# Altium schematic sheet 1_P1.schdoc
size 309 x 223 mm; Symbol: Sheet-Symbol_A4; Device: Sheet-Symbol_A4; @Page Name: P1; @Create Date: 2023-08-24; @Page Count: 1; @Page No: 1; @Project Name: 5Vcharge_2023-08-24_11-31-12; @Schematic Name: Schematic1; @Update Date: 2023-09-03; Company: 嘉立创EDA; Page Size: A4; Version: V1.0
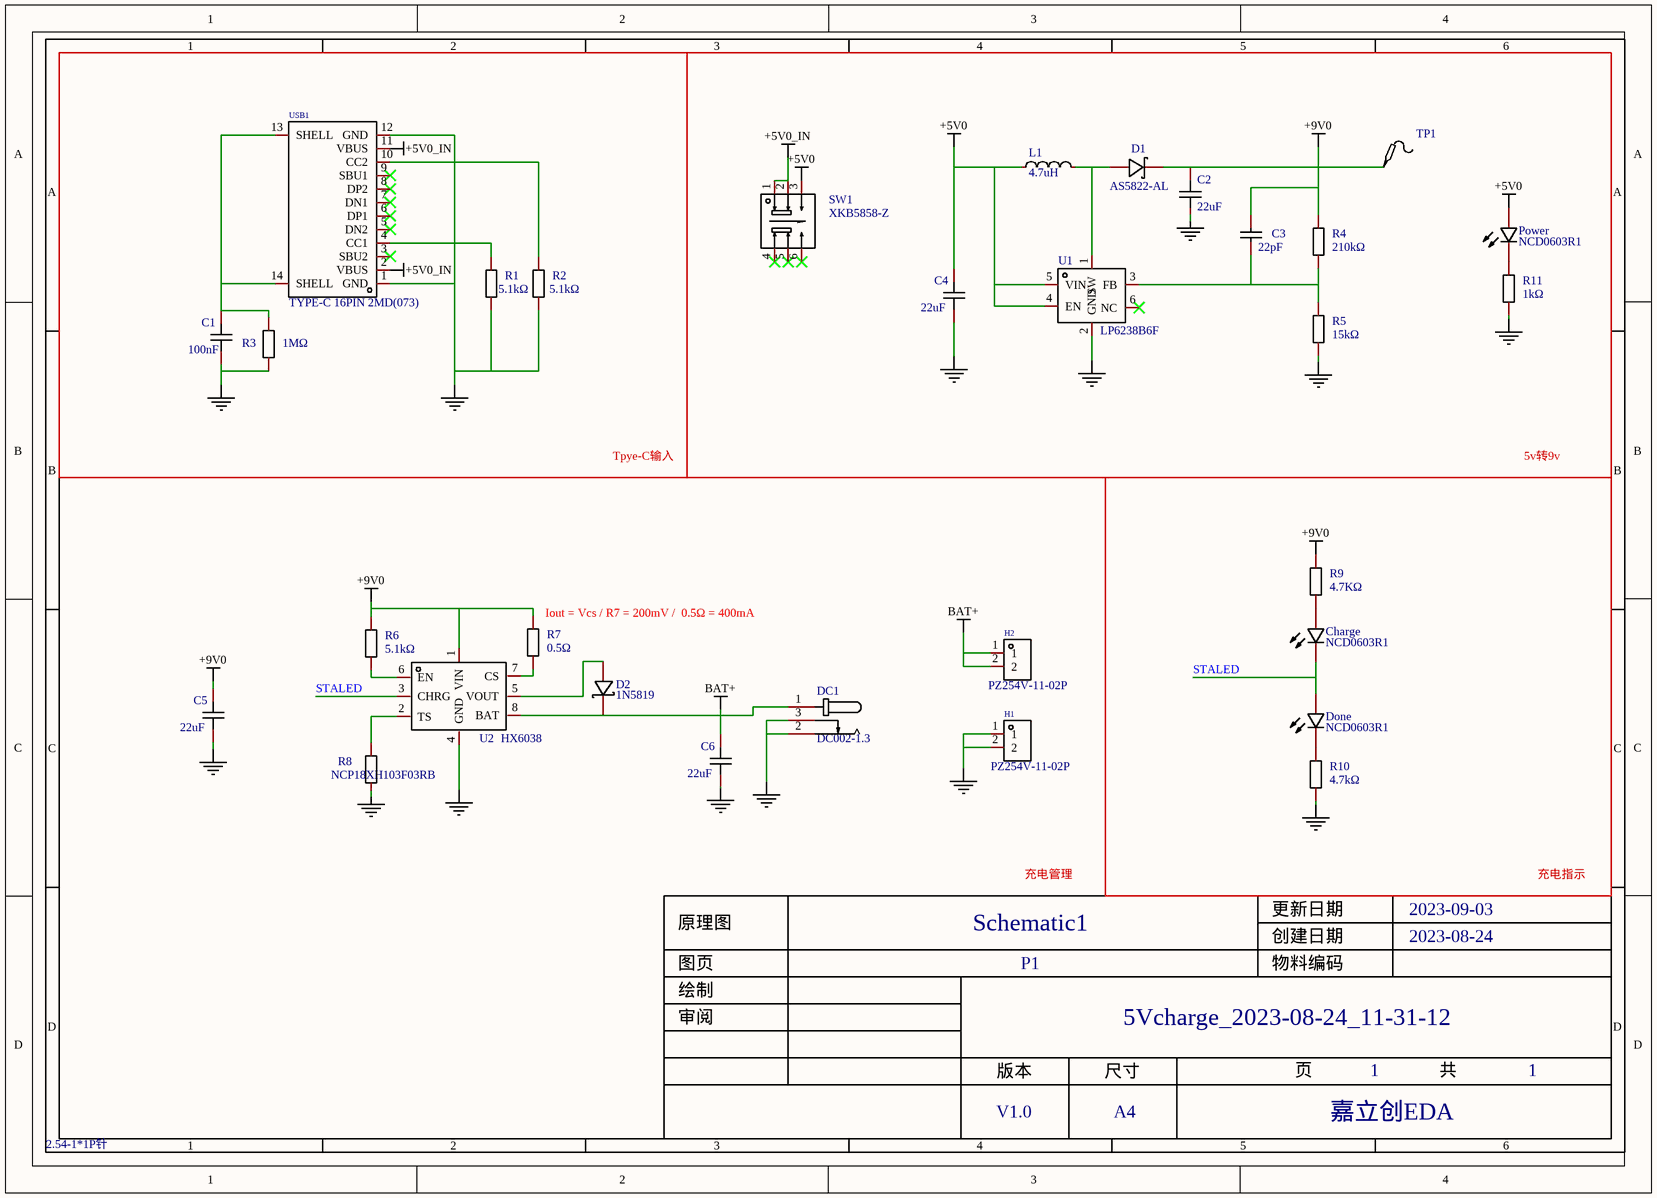
[diagram p0: 1_P1.schdoc]

## Parts
C1  100nF  [C0603]
C2  22uF  [C1206]
C3  22pF  [C0603]
C4  22uF  [C1206]
C5  22uF  [C1206]
C6  22uF  [C1206]
Charge  NCD0603R1  [LED0603-RD_RED]
D1  AS5822-AL  [SMA-L_L4.4-W2.6-LS5.0-RD]
D2  1N5819  [SMA_L4.4-W2.6-LS5.0-RD]
DC1  DC002-1.3  [DC-IN-TH_DC002-1.3]
Done  NCD0603R1  [LED0603-RD_RED]
H1  PZ254V-11-02P  [HDR-TH_2P-P2.54-V-M]
H2  PZ254V-11-02P  [HDR-TH_2P-P2.54-V-M]
L1  4.7uH  [IND-SMD_L4.0-W4.0]
Power  NCD0603R1  [LED0603-RD_RED]
R1  5.1kΩ  [R0603]
R2  5.1kΩ  [R0603]
R3  1MΩ  [R0603]
R4  210kΩ  [R0603]
R5  15kΩ  [R0603]
R6  5.1kΩ  [R0603]
R7  0.5Ω  [R0603]
R8  NCP18XH103F03RB  [R0603]
R9  4.7KΩ  [R0603]
R10  4.7kΩ  [R0603]
R11  1kΩ  [R0603]
SW1  XKB5858-Z  [SW-TH_6P-L5.8-W5.8-P2.00-LS4.5-BL]
TP1  2.54-1*1P针  [HDR-TH_1P-P2.54-V-M]
U1  LP6238B6F  [SOT-23-6_L2.9-W1.6-P0.95-LS2.8-BL]
U2  HX6038  [ESOP-8_L4.9-W3.9-P1.27-LS6.0-BL-EP]
USB1  TYPE-C 16PIN 2MD(073)  [USB-C-SMD_TYPE-C-6PIN-2MD-073]

## Blocks framed on the sheet
Tpye-C输入: C1 R1-R3 USB1
5v转9v: C2-C4 D1 L1 Power R4 R5 R11 SW1 TP1 U1

## Nets
+5V0: C4.2 L1.1 Power.2(A) SW1.3 U1.4(EN) U1.5(VIN)
+5V0_IN: SW1.1 SW1.2 USB1.2(VBUS) USB1.11(VBUS)
+9V0: C2.2 C3.2 C5.2 D1.1(A) R4.2 R6.1 R7.1 R9.1 TP1.1 U2.1(VIN)
BAT+: C6.2 D2.1(C) DC1.1 H2.1 H2.2 U2.8(BAT)
NetC1_1: C1.1 C2.1 C4.1 C5.1 C6.1 DC1.2 DC1.3 H1.1 H1.2 R1.2 R2.2 R3.1 R5.2 R8.2 R10.2 R11.2 U1.2(GND) U2.4(GND) USB1.1(GND) USB1.12(GND)
STALED: Charge.1(K) Done.2(A) U2.3(CHRG)
NetC1_2: C1.2 R3.2 USB1.13(SHELL) USB1.14(SHELL)
NetC3_1: C3.1 R4.1 R5.1 U1.3(FB)
NetCharge_2: Charge.2(A) R9.2
NetD1_2: D1.2(K) L1.2 U1.1(SW)
NetD2_2: D2.2(A) U2.5(VOUT)
NetDone_1: Done.1(K) R10.1
NetPower_1: Power.1(K) R11.1
NetR1_1: R1.1 USB1.4(CC1)
NetR2_1: R2.1 USB1.10(CC2)
NetR6_2: R6.2 U2.6(EN)
NetR7_2: R7.2 U2.7(CS)
NetR8_1: R8.1 U2.2(TS)

Not connected (* = marked no-connect by the designer): SW1 4* 5* 6*; U1 6(NC)*; USB1 3(SBU2)* 5(DN2)* 6(DP1)* 7(DN1)* 8(DP2)* 9(SBU1)*

## Notes on the sheet
- (near R7) Iout = Vcs / R7 = 200mV /  0.5Ω = 400mA
- 充电管理
- 充电指示
- 1
- 2
- 3
- 4
- 5
- 6
- A
- B
- C
- 原理图
- Schematic1
- 创建日期
- 更新日期
- 2023-08-24
- 2023-09-03
- 审阅
- 绘制
- 图页
- P1
- 物料编码
- 5Vcharge_2023-08-24_11-31-12
- D
- 版本
- 尺寸
- 页
- 共
- V1.0
- A4
- 嘉立创EDA

## Library data of the parts
C1 = CC0603KRX7R9BB104: 容值:100nF;精度:±10%;额定电压:50V;材质(温度系数):X7R;; Manufacturer: YAGEO(国巨); Add into BOM: yes; Tolerance: ±10%; Voltage Rated: 50V; Temperature Coefficient: X7R; Name: 100nF; Symbol: CC0603KRX7R9BB104; Device: CC0603KRX7R9BB104; LCSC Part Name: 100nF ±10% 50V; Supplier Part: C14663; Manufacturer Part: CC0603KRX7R9BB104; Supplier Footprint: 0603; JLCPCB Part Class: 基础库; Datasheet: https://atta.szlcsc.com/upload/public/pdf/source/20180910/C282072_33301C7F631E79921B82A8DAC6BCC5B3.pdf; Supplier: LCSC; Convert to PCB: yes; Value: 100nF
C2 C4-C6 = CL31A226KAHNNNE: 容值:22uF;精度:±10%;额定电压:25V;材质(温度系数):X5R;; Manufacturer: SAMSUNG(三星); Symbol: CC0603KRX7R9BB104; Add into BOM: yes; Tolerance: ±10%; Voltage Rated: 25V; Temperature Coefficient: X5R; Name: 22uF; Device: CL31A226KAHNNNE; LCSC Part Name: 22uF ±10% 25V; Supplier Part: C12891; Manufacturer Part: CL31A226KAHNNNE; Supplier Footprint: 1206; JLCPCB Part Class: Basic Part; Datasheet: https://atta.szlcsc.com/upload/public/pdf/source/20160103/1457707667836.pdf; Supplier: LCSC; Convert to PCB: yes; Value: 22uF
C3 = CC0603JRNPO9BN220: 容值:22pF;精度:±5%;额定电压:50V;材质(温度系数):NP0;; Manufacturer: YAGEO(国巨); Add into BOM: yes; Tolerance: ±5%; Voltage Rated: 50V; Temperature Coefficient: NP0; Name: 22pF; Symbol: CC0603JRNPO9BN220; Device: CC0603JRNPO9BN220; LCSC Part Name: 22pF ±5% 50V; Supplier Part: C105620; Manufacturer Part: CC0603JRNPO9BN220; Supplier Footprint: 0603; JLCPCB Part Class: 扩展库; Datasheet: https://atta.szlcsc.com/upload/public/pdf/source/20170425/1493115771353.pdf; Supplier: LCSC; Convert to PCB: yes; Value: 22pF
Charge Done Power = NCD0603R1_C84263: 发光颜色:红灯;; Manufacturer: 国星光电; Symbol: FC-DA1608HRK-620D; Add into BOM: yes; Emitted Color: 红灯; Name: NCD0603R1; Device: NCD0603R1_C84263; LCSC Part Name: 红灯; Supplier Part: C84263; Manufacturer Part: NCD0603R1; Supplier Footprint: 0603; JLCPCB Part Class: 扩展库; Datasheet: https://atta.szlcsc.com/upload/public/pdf/source/20200820/C84263_DABC6A75E58F576973B407FDBA283D60.pdf; Supplier: LCSC; Convert to PCB: yes
D1 = AS5822-AL: 二极管配置:独立式;直流反向耐压(Vr):40V;平均整流电流(Io):3A;正向压降(Vf):500mV@3A;反向电流(Ir):500uA@40V;; Manufacturer: AnBon(安邦); Add into BOM: yes; Diode Configuration: 独立式; Reverse Voltage (Vr): 40V; Average Rectified Current (Io): 3A; Name: AS5822-AL; Symbol: AS5822-AL; Device: AS5822-AL; LCSC Part Name: 40V 3A 500mV@3A; Supplier Part: C541626; Manufacturer Part: AS5822-AL; Supplier Footprint: SMA-L; JLCPCB Part Class: 扩展库; Datasheet: https://atta.szlcsc.com/upload/public/pdf/source/20200522/C541626_33A66A3E2FF9744A21A92C9F131053A6.pdf; Supplier: LCSC; Convert to PCB: yes; Forward Voltage (Vf@If): 500mV@3A; Reverse Leakage Current (Ir): 500uA@40V
D2 = 1N5819_C437199: 直流反向耐压(Vr):40V;平均整流电流(Io):1A;正向压降(Vf):500mV@1A;; Manufacturer: KEXIN(科信); Add into BOM: yes; Reverse Voltage (Vr): 40V; Average Rectified Current (Io): 1A; Name: 1N5819; Symbol: 1N5819_C437199; Device: 1N5819_C437199; LCSC Part Name: 40V 1A 500mV@1A; Supplier Part: C437199; Manufacturer Part: 1N5819; Supplier Footprint: SMA; JLCPCB Part Class: 扩展库; Datasheet: https://atta.szlcsc.com/upload/public/pdf/source/20191012/C437199_83583E622A6684E767605E43C169C596.pdf; Supplier: LCSC; Convert to PCB: yes; Forward Voltage (Vf@If): 500mV@1A
DC1 = DC002-1.3: 连接器类型:DC电源插座;安装方式:弯插;触点内径:2mm;触点外径:6.3mm;额定电流:500mA;额定电压:30V;工作温度范围:-40℃~+55℃;; Manufacturer: SHOU HAN(首韩); Symbol: DC005_C431533; Add into BOM: yes; Connector Type: DC电源插座; Inside Contact Diameter: 2mm; Outside Contact Diameter: 6.3mm; Current Rating (Max): 500mA; Voltage Rating (Max): 30V; Name: DC002-1.3; Device: DC002-1.3; LCSC Part Name: DC座 DC-002 内芯1.3 圆针 3脚插件DC; Supplier Part: C668593; Manufacturer Part: DC002-1.3; Supplier Footprint: Through Hole; JLCPCB Part Class: Extended Part; Datasheet: https://atta.szlcsc.com/upload/public/pdf/source/20200619/C668593_6B5785499F122503841AA69BD23A954B.pdf; Supplier: LCSC; Convert to PCB: yes; Mounting Style: 弯插; Operating Temperature Range: -40℃~+55℃
H1 H2 = PZ254V-11-02P: 排数:单排;总PIN位数:2P;间距:2.54mm;插针结构:1x2P;行距:-;安装类型:直插;圆针/方针:方针;额定电流:-;额定电压:-;配合针长度:6mm;塑高:2.5mm;端接针长度:3mm;触头材质:黄铜;触头镀层:-;工作温度范围:-40℃~+105℃;颜色:黑色;; Manufacturer: XFCN(兴飞); Add into BOM: yes; Pitch: 2.54mm; Pin Structure: 1x2P; Circluar Pins/Square Pins: 方针; Name: PZ254V-11-02P; Symbol: PZ254V-11-02P; Device: PZ254V-11-02P; LCSC Part Name: 2.54mm 1x2P 直插 方针; Supplier Part: C492401; Manufacturer Part: PZ254V-11-02P; Supplier Footprint: 插件,P=2.54mm; JLCPCB Part Class: 扩展库; Datasheet: https://atta.szlcsc.com/upload/public/pdf/source/20200309/C492401_A812433581A9B211A7FFA413ADDFF0E5.pdf; Supplier: LCSC; Convert to PCB: yes; Number of Rows: 单排; Number of Pins: 2P; Row Spacing: -; Mounting Type: 直插; Current Rating (Max): -; Voltage Rating (Max): -; Length of Mating Pin: 6mm; Insulation Height: 2.5mm; Length of End Connection Pin: 3mm; Contact Material: 黄铜; Contact Plating: -; Operating Temperature Range: -40℃~+105℃; Color: 黑色
L1 = SWPA4030S4R7MT: 直流电阻(DCR):78mΩ;精度:±20%;电感值:4.7uH;额定电流:2A;; Manufacturer: Sunlord(顺络); Add into BOM: yes; DC Resistance (DCR): 78mΩ; Tolerance: ±20%; Rated Current: 2A; Name: 4.7uH; Symbol: SWPA4030S4R7MT; Device: SWPA4030S4R7MT; LCSC Part Name: 4.7uH ±20%; Supplier Part: C57269; Manufacturer Part: SWPA4030S4R7MT; Supplier Footprint: SMD; JLCPCB Part Class: 扩展库; Datasheet: https://atta.szlcsc.com/upload/public/pdf/source/20161024/1477287957557.pdf; Supplier: LCSC; Convert to PCB: yes; Height: 3mm; Value: 4.7uH; Width: 4mm; Length: 4mm
R1 R2 R5-R7 R9-R11 = 0603WAF5101T5E: 电阻类型:厚膜电阻;阻值:5.1kΩ;精度:±1%;功率:100mW;; Manufacturer: UNI-ROYAL(厚声); Add into BOM: yes; Tolerance: ±1%; Power(Watts): 100mW; Temperature Coefficient: ±100ppm/℃; Overload Voltage (Max): 75V; Symbol: 0603WAF5101T5E; Device: 0603WAF5101T5E; LCSC Part Name: 5.1kΩ ±1% 100mW; Supplier Part: C23186; Manufacturer Part: 0603WAF5101T5E; Supplier Footprint: 0603; JLCPCB Part Class: Basic Part; Datasheet: https://atta.szlcsc.com/upload/public/pdf/source/20200306/C422600_1E6D84923E4A46A82E41ADD87F860B5C.pdf; Supplier: LCSC; Convert to PCB: yes; Type: 厚膜电阻; Operating Temperature Range: -55℃~+155℃
  R1 R2 R6: Name: 5.1kΩ; Value: 5.1kΩ
  R5: Name: 15kΩ; Value: 15kΩ
  R7: Name: 0.5Ω; Value: 0.5Ω
  R9: Name: 4.7KΩ; Value: 4.7KΩ
  R10: Name: 4.7kΩ; Value: 4.7kΩ
  R11: Name: 1kΩ; Value: 1kΩ
R3 = 0603WAF1002T5E: 电阻类型:厚膜电阻;阻值:10kΩ;精度:±1%;功率:100mW;; Manufacturer: UNI-ROYAL(厚声); Add into BOM: yes; Tolerance: ±1%; Power(Watts): 100mW; Temperature Coefficient: ±100ppm/℃; Overload Voltage (Max): 75V; Name: 1MΩ; Symbol: 0603WAF1002T5E; Device: 0603WAF1002T5E; LCSC Part Name: 厚膜电阻 10kΩ ±1% 100mW; Supplier Part: C25804; Manufacturer Part: 0603WAF1002T5E; Supplier Footprint: 0603; JLCPCB Part Class: 基础库; Datasheet: https://atta.szlcsc.com/upload/public/pdf/source/20200306/C422600_1E6D84923E4A46A82E41ADD87F860B5C.pdf; Supplier: LCSC; Convert to PCB: yes; Type: 厚膜电阻; Value: 1MΩ; Operating Temperature Range: -55℃~+155℃
R4 = 0603WAF2103T5E: 电阻类型:厚膜电阻;阻值:210kΩ;精度:±1%;功率:100mW;; Manufacturer: UNI-ROYAL(厚声); Add into BOM: yes; Tolerance: ±1%; Power(Watts): 100mW; Temperature Coefficient: ±100ppm/℃; Overload Voltage (Max): 75V; Name: 210kΩ; Symbol: 0603WAF2103T5E; Device: 0603WAF2103T5E; LCSC Part Name: 210kΩ ±1% 100mW; Supplier Part: C22952; Manufacturer Part: 0603WAF2103T5E; Supplier Footprint: 0603; JLCPCB Part Class: Extended Part; Datasheet: https://atta.szlcsc.com/upload/public/pdf/source/20200306/C422600_1E6D84923E4A46A82E41ADD87F860B5C.pdf; Supplier: LCSC; Convert to PCB: yes; Type: 厚膜电阻; Value: 210kΩ; Operating Temperature Range: -55℃~+155℃
R8 = NCP18XH103F03RB: 阻值(25℃):10kΩ;电阻精度:±1%;B值精度:±1%;B值(25℃/50℃):3380K;功率:100mW;最大稳态电流(25℃):310uA;B值(25℃/75℃):-;B值(25℃/85℃):3334K;B值(25℃/100℃):3455K;工作温度:-40℃~+125℃;; Manufacturer: muRata(村田); Symbol: 0603WAF5101T5E; Add into BOM: yes; Resistance @ 25℃: 10kΩ; Resistance Tolerance: ±1%; B Constant (25℃/50℃): 3380K; Power: 100mW; Steady State Current (Max): 310uA; B Constant (25℃/85℃): 3334K; B Constant (25℃/100℃): 3455K; Temperature Coefficient: ±100ppm/℃; Overload Voltage (Max): 75V; Value: 10kΩ; Name: NCP18XH103F03RB; Device: NCP18XH103F03RB; LCSC Part Name: 10kΩ 电阻精度:±1% 3380K; Supplier Part: C13564; Manufacturer Part: NCP18XH103F03RB; Supplier Footprint: 0603; JLCPCB Part Class: Extended Part; Datasheet: https://atta.szlcsc.com/upload/public/pdf/source/20130819/1457706638081.pdf; Supplier: LCSC; Convert to PCB: yes; B Constant Tolerance: ±1%; B Constant (25℃/75℃): -; Operating Temperature: -40℃~+125℃; Type: 厚膜电阻; Tolerance: ±1%; Power(Watts): 100mW; Operating Temperature Range: -55℃~+155℃
SW1 = XKB5858-Z: 触点电流:100mA;额定电压 (AC):250V;额定电压 (DC):30V;绝缘电阻:100MΩ;电路结构:-;安装方式:直插;自锁/无锁:自锁;按键形状:矩形按钮;按键/盖帽颜色:白色;带灯:无;引脚样式:PC引脚;作用力:160gf@±80gf;防护等级:-;工作温度:-15℃~+55℃;机械寿命:10000;; Manufacturer: XKB Connectivity(中国星坤); Add into BOM: yes; Contact Current: 100mA; Voltage Rating (AC): 250V; Voltage Rating (DC): 30V; Insulation Resistance: 100MΩ; Self Lock / No Lock: 自锁; Actuator Style: 矩形按钮; Actuator/Cap Color: 白色; With Lamp: 无; Pin Style: PC引脚; Mechanical Life: 10000; Name: XKB5858-Z; Symbol: XKB5858-Z; Device: XKB5858-Z; LCSC Part Name: 按键开关   5.8*5.8插件自锁开关; Supplier Part: C318868; Manufacturer Part: XKB5858-Z; Supplier Footprint: 插件; JLCPCB Part Class: 扩展库; Datasheet: https://atta.szlcsc.com/upload/public/pdf/source/20181029/C318868_9BE55E0EBE6A2C886ABBB20B390835AF.pdf; Supplier: LCSC; Convert to PCB: yes; Circuit: -; Mounting Style: 直插; Operating Force: 160gf@±80gf; IP Rating: -; Operating Temperature: -15℃~+55℃
TP1 = 2.54-1*1P针: 排数:单排;总PIN位数:1P;间距:-;插针结构:-;行距:-;安装类型:直插;圆针/方针:-;额定电流:-;额定电压:-;配合针长度:-;塑高:-;触头材质:-;触头镀层:-;颜色:黑色;; Manufacturer: BOOMELE(博穆精密); Symbol: Test-Point; Add into BOM: yes; Name: 2.54-1*1P针; Device: 2.54-1*1P针; LCSC Part Name: 直插; Supplier Part: C81276; Manufacturer Part: 2.54-1*1P针; Supplier Footprint: 插件,P=2.54mm; JLCPCB Part Class: Extended Part; Datasheet: https://atta.szlcsc.com/upload/public/pdf/source/20221018/3E9408392E35E6F57A28985E5F7BF5C9.pdf; Supplier: LCSC; Convert to PCB: yes; Number of Rows: 单排; Number of Pins: 1P; Pitch: -; Pin Structure: -; Row Spacing: -; Mounting Type: 直插; Circluar Pins/Square Pins: -; Current Rating (Max): -; Voltage Rating (Max): -; Length of Mating Pin: -; Insulation Height: -; Contact Material: -; Contact Plating: -; Color: 黑色
U1 = LP6238B6F: 2.6A MOS电流; Manufacturer: LOWPOWER(微源半导体); Add into BOM: yes; Name: LP6238B6F; Symbol: LP6238B6F; Device: LP6238B6F; LCSC Part Name: LP6238B6F; Supplier Part: C387749; Manufacturer Part: LP6238B6F; Supplier Footprint: SOT23-6; JLCPCB Part Class: 扩展库; Datasheet: https://atta.szlcsc.com/upload/public/pdf/source/20190410/C387749_B2830DEFAFD91B88E3FC61060F9C6EEA.pdf; Supplier: LCSC; Convert to PCB: yes
U2 = IP2312U: Manufacturer: INJOINIC(英集芯); Add into BOM: yes; Name: HX6038; Symbol: IP2312U; Device: IP2312U; LCSC Part Name: 降压开关充电 停产; Supplier Part: C2687800; Manufacturer Part: HX6038; Supplier Footprint: SOP-8L; JLCPCB Part Class: 扩展库; Datasheet: https://atta.szlcsc.com/upload/public/pdf/source/20200908/C605432_A60BD6D88F2FAE4109BDCDD377258269.pdf; Supplier: LCSC; Convert to PCB: yes
USB1 = TYPE-C 16PIN 2MD(073): 连接器类型:Type-C;标准:-;公母:母座;触点数量:16;端口数量:1;安装方式:卧贴;额定电流 - 电源:5A;工作温度范围:-25℃~+85℃;; Manufacturer: SHOU HAN(首韩); Add into BOM: yes; Gender: 母座; Number of Contacts: 16; Number of Ports: 1; Current Rating - Power (Max): 5A; Name: TYPE-C 16PIN 2MD(073); Symbol: TYPE-C 16PIN 2MD(073); Device: TYPE-C 16PIN 2MD(073); LCSC Part Name: TYPE-C母座 16P 4脚插件带定位柱 不锈钢外壳 2次模顶; Supplier Part: C2765186; Manufacturer Part: TYPE-C 16PIN 2MD(073); Supplier Footprint: SMD; JLCPCB Part Class: 扩展库; Supplier: LCSC; Convert to PCB: yes; Connector Type: Type-C; Standard: -; Mounting Style: 卧贴; Operating Temperature Range: -25℃~+85℃